# Altium schematic sheet 600W INV MCU-2.SchDoc
size A4
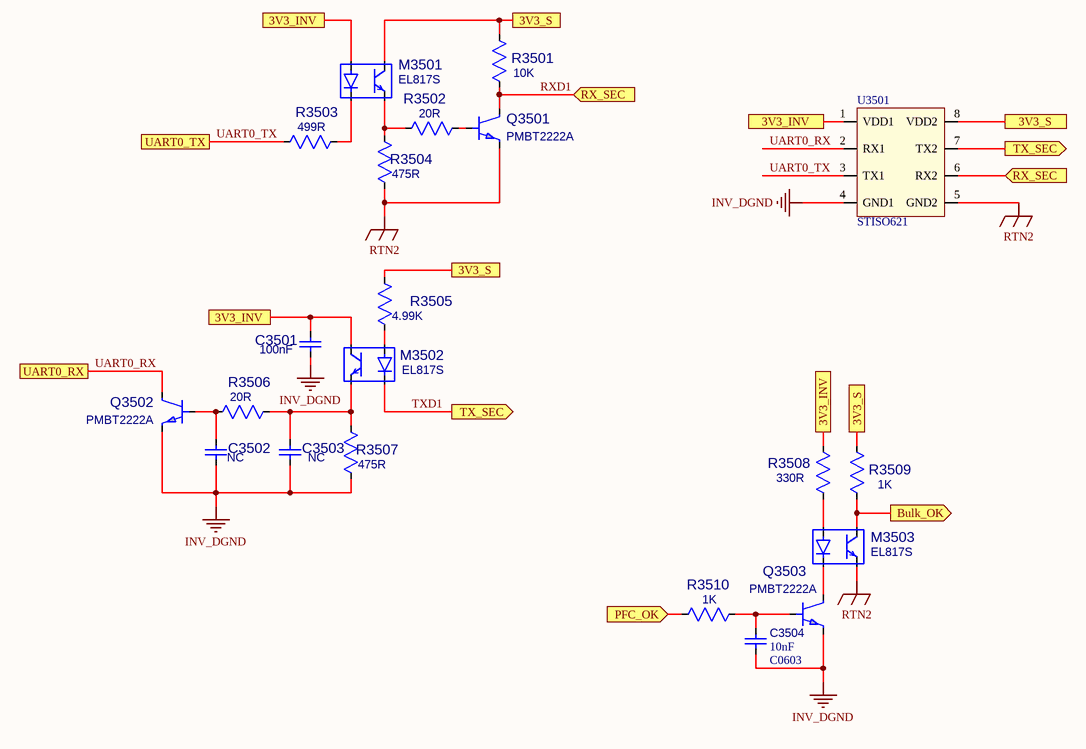
[diagram p0: 600W INV MCU-2.SchDoc]

## Parts
C3501  100nF  [C0603L]
C3502  NC  [C0603L]
C3503  NC  [C0603L]
C3504  10nF  [C0603L]
M3501  EL817S  [PHOTO-PS2561DLA]
M3502  EL817S  [PHOTO-PS2561DLA]
M3503  EL817S  [PHOTO-PS2561DLA]
Q3501  PMBT2222A  [SOT23-CBE]
Q3502  PMBT2222A  [SOT23-CBE]
Q3503  PMBT2222A  [SOT23-CBE]
R3501  10K  [R0603L]
R3502  20R  [R0603L]
R3503  499R  [R0603L]
R3504  475R  [R0603L]
R3505  4.99K  [R0603L]
R3506  20R  [R0603L]
R3507  475R  [R0603L]
R3508  330R  [R0603L]
R3509  1K  [R0603L]
R3510  1K  [R0603L]
U3501  STISO621  [SO8]

## Ports
3V3_INV, 3V3_S, Bulk_OK (out), PFC_OK (in), RX_SEC (in), TX_SEC (out), UART0_RX, UART0_TX

## Nets
INV_DGND: C3501.2 C3502.2 C3503.2 C3504.1 Q3502.E Q3503.E R3507.1 U3501.4(GND1)
RTN2: M3503.3 Q3501.E R3504.1 U3501.5(GND2)
3V3_INV: C3501.1 M3501.1 M3502.4 R3508.2 U3501.1(VDD1) ; port 3V3_INV
3V3_S: M3501.4 R3501.2 R3505.2 R3509.2 U3501.8(VDD2) ; port 3V3_S
Bulk_OK: M3503.4 R3509.1 ; port Bulk_OK
PFC_OK: R3510.2 ; port PFC_OK
RXD1: Q3501.C R3501.1 U3501.6(RX2) ; port RX_SEC
TXD1: M3502.2 U3501.7(TX2) ; port TX_SEC
UART0_RX: Q3502.C U3501.2(RX1) ; port UART0_RX
UART0_TX: R3503.2 U3501.3(TX1) ; port UART0_TX
NetC3502_1: C3502.1 Q3502.B R3506.2
NetC3503_1: C3503.1 M3502.3 R3506.1 R3507.2
NetC3504_2: C3504.2 Q3503.B R3510.1
NetM3501_2: M3501.2 R3503.1
NetM3501_3: M3501.3 R3502.2 R3504.2
NetM3502_1: M3502.1 R3505.1
NetM3503_1: M3503.1 R3508.1
NetM3503_2: M3503.2 Q3503.C
NetQ3501_B: Q3501.B R3502.1

## Library data of the parts
C3501-C3504 = C0603: package: C0603; OPEN: OPEN
M3501-M3503 = PHOTO-PS2561DLA: PackageOutlineLayer: 2mm; Value: {Value}; ModifyDate: 06/28/2010 14:14:37; SubKind: *; VEN: *; VENPN: *; PartNumber: *; S3: *; S2: *; S1: *; DSC: *; DESC: *; S5: *; ComponentHeight: 2mm
Q3501-Q3503 = NPN: SOT-23-NPN; package: SOT-23; PartNumber: *
R3501-R3510 = R0603: package: R0603
U3501 = STISO621: LM358